# Altium project River Level Sensor Datalogger.PrjPcb
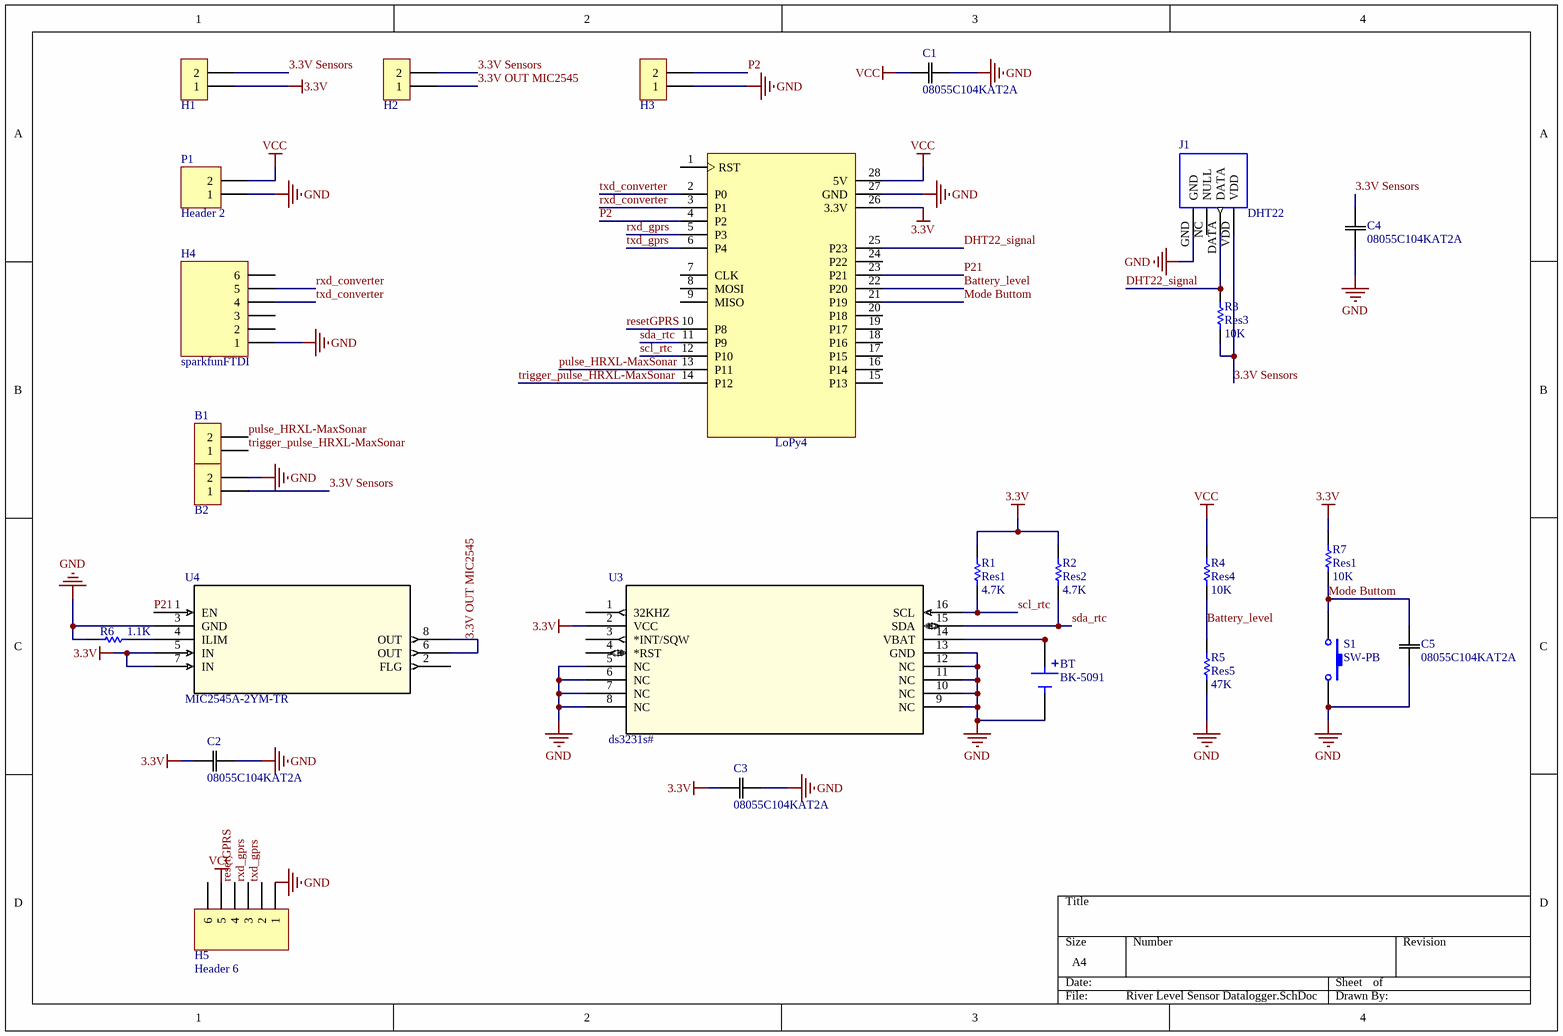
[diagram p0: River Level Sensor Datalogger.SchDoc]
1 sheet, 26 parts. Net scope: global (net labels, ports and power ports of the same name join across sheets).
Board file: River Level Sensor Datalogger.PcbDoc

## Sheet River Level Sensor Datalogger.SchDoc
size A4

### Parts
B1  Borne  [BORNE2]  (value not drawn)
B2  Borne  [BORNE2]  (value not drawn)
BT  BK-5091  [BAT_BK-5091]
C1  08055C104KAT2A  [CAP_X7R_0805_AVX]
C2  08055C104KAT2A  [CAP_X7R_0805_AVX]
C3  08055C104KAT2A  [CAP_X7R_0805_AVX]
C4  08055C104KAT2A  [CAP_X7R_0805_AVX]
C5  08055C104KAT2A  [CAP_X7R_0805_AVX]
H1  Header  [Header 1X2]  (value not drawn)
H2  Header  [Header 1X2]  (value not drawn)
H3  Header  [Header 1X2]  (value not drawn)
H4  sparkfunFTDI  [sparkfunFTDI]
H5  Header 6  [Header 1X6]
J1  DHT22  [DHT22]
P1  Header 2  [BORNERA25-2]
R1  Res1  value 4.7K  [0805]
R2  Res2  value 4.7K  [0805]
R3  Res3  value 10K  [0805]
R4  Res4  value 10K  [0805]
R5  Res5  value 47K  [0805]
R6  value 1.1K  [0805]
R7  Res1  value 10K  [0805]
S1  SW-PB  [BUTTON-1-SMD]
U2  LoPy4  [LoPy]
U3  ds3231s#  [21-0042B_16_MXM]
U4  MIC2545A-2YM-TR  [SOP-8_MCH]

### Nets
3.3V: C2.2 C3.2 H1.1 R1.1 R2.1 R7.1 U2.26(3.3V) U3.2(VCC) U4.5(IN) U4.7(IN)
GND: B2.2 BT.NEG C1.1 C2.1 C3.1 C4.1 C5.1 H3.1 H4.1 H5.1 J1.GND P1.1 R5.2 R6.1 S1.2 U2.27(GND) U3.5(NC) U3.6(NC) U3.7(NC) U3.8(NC) U3.9(NC) U3.10(NC) U3.11(NC) U3.12(NC) U3.13(GND) U4.3(GND)
VCC: C1.2 H5.5 P1.2 R4.1 U2.28(5V)
3.3V OUT MIC2545: H2.1 U4.6(OUT) U4.8(OUT)
3.3V Sensors: B2.1 C4.2 H1.2 H2.2 J1.VDD R3.2
Battery_level: R4.2 R5.1 U2.22(P20)
DHT22_signal: J1.DATA R3.1 U2.25(P23)
Mode Buttom: C5.2 R7.2 S1.1 U2.21(P19)
P2: H3.2 U2.4(P2)
P21: U2.23(P21) U4.1(EN)
pulse_HRXL-MaxSonar: B1.2 U2.13(P11)
resetGPRS: H5.4 U2.10(P8)
rxd_converter: H4.5 U2.3(P1)
rxd_gprs: H5.3 U2.5(P3)
scl_rtc: R1.2 U2.12(P10) U3.16(SCL)
sda_rtc: R2.2 U2.11(P9) U3.15(SDA)
trigger_pulse_HRXL-MaxSonar: B1.1 U2.14(P12)
txd_converter: H4.4 U2.2(P0)
txd_gprs: H5.2 U2.6(P4)
NetBT_1+: BT.1+(POS) BT.2+(POS) U3.14(VBAT)
NetR6_2: R6.2 U4.4(ILIM)

Not connected (* = marked no-connect by the designer): H4 2 3 6; H5 6; J1 NC(NULL); U2 1(RST) 7(CLK) 8(MOSI) 9(MISO) 15(P13) 16(P14) 17(P15) 18(P16) 19(P17) 20(P18) 24(P22); U3 1(32KHZ) 3(*INT/SQW) 4(*RST); U4 2(FLG)

### Library data of the parts
B1 B2 = Borne2: Terminal Atornillable 2 salidas
BT = BK-5091: Battery Retainer Coin, 11.6mm 1 Cell PC Pin; MF: MPD; SnapEDA_Link: https://www.snapeda.com/parts/BK-5091/MPD/view-part/4480565/?ref=snap; Value: *; MP: BK-5091; DigiKey-Purchase-URL: https://snapeda.com/shop?store=DigiKey&id=4480565; Package: None; Digi-Key_Part_Number: BK-5091-ND
C1-C5 = 08055C104KAT2A: No Description Available; Vendor: AVX Corporation; Built_By: EMA_UL_Team; SourceLibrary: AVX_2012-08-08; Type: DEV; Manufacturer_Part_Number: 08055C104KAT2A; Copyright: Copyright (C) 2018 Accelerated Designs. All rights reserved; RefDes: RefDes
H1-H3 = Header 2: Header 2 pin
H4 = sparkfunFTDI: Header, 6-Pin; LatestRevisionDate: 17-Jul-2002; LatestRevisionNote: Re-released for DXP Platform.; Publisher: Altium Limited
H5 = Header 6: Header, 6-Pin; LatestRevisionDate: 17-Jul-2002; LatestRevisionNote: Re-released for DXP Platform.; Publisher: Altium Limited
J1 = DHT22: Capacitive-type humidity and temperature module/sensor; MF: Aosong Electronics; MP: DHT22; Value: *; Check_prices: https://www.snapeda.com/parts/DHT22/Aosong%20Electronics/view-part/5164503/?ref=eda; Package: Package; Availability: Unavailable; Price: None; SnapEDA_Link: https://www.snapeda.com/parts/DHT22/Aosong%20Electronics/view-part/5164503/?ref=snap
P1 = Header 2: Header, 2-Pin; LatestRevisionDate: 17-Jul-2002; LatestRevisionNote: Re-released for DXP Platform.; Publisher: Altium Limited
R1-R7 = Res1: Resistor; Published: 8-Jun-2000; LatestRevisionDate: 17-Jul-2002; LatestRevisionNote: Re-released for DXP Platform.; PackageReference: AXIAL-0.3; Publisher: Altium Limited; PackageDescription: Axial Device, Thru-Hole; 2 Leads; 0.3 in Pin Spacing
S1 = SW-PB: Switch; Published: 24-Mar-1999; LatestRevisionDate: 17-Jul-2002; LatestRevisionNote: Re-released for DXP Platform.; PackageReference: SPST-2; Publisher: Altium Limited; PackageDescription: Switch; 2 Leads
U2 = LoPy: LoPy, Wifi and Bluetooth Microcontroller, 4M RAM, 4 MHz, 28-Pin, 3.0 to 5.5V Supply Range, Commercial Temperature; ComponentAvailability: Unknown. Contact manufacturer to determine status.; Published: 11-Oct-2004; LatestRevisionDate: 29-Jan-2009; LatestRevisionNote: Sch. layout revised. 3D Model Removed.; DatasheetVersion: revD, Mar-2002; PackageVersion: revBB, Aug-2009; PackageReference: PDIP600-P28; Publisher: Altium Limited; PackageDescription: 28-Lead Plastic Dual In-Line (P) - 600 mil Body [PDIP]; Supplier 1: Digi-Key; Supplier Part Number 1: PIC16C55A-04/P-ND; Supplier 2: Farnell; Supplier Part Number 2: 1523784; Supplier 3: Farnell; Supplier Part Number 3: 1084287; Code_JEDEC: MO-011; ComponentLink1Description: Datasheet; ComponentLink1URL: http://ww1.microchip.com/downloads/en/DeviceDoc/30453d.pdf; ComponentLink2Description: Packaging Specification; ComponentLink2URL: http://www.microchip.com/stellent/groups/techpub_sg/documents/packagingspec/en012702.pdf; ComponentLink3Description: Microchip.com Home; ComponentLink3URL: http://www.microchip.com/
U3 = ds3231s#: No Description Available; Vendor: Maxim Integrated Products; Built_By: EMA_UL_Team; SourceLibrary: Maxim_2009-12-17_1; Manufacturer_Part_Number: ds3231s#; Copyright: Copyright (C) 2018 Accelerated Designs. All rights reserved; RefDes: RefDes; Type: DEV
U4 = MIC2545A-2YM-TR: No Description Available; Vendor: Microchip; Built_By: EMA_Molly; SourceLibrary: Microchip_2019-09-03; Manufacturer_Part_Number: MIC2545A-2YM-TR; Copyright: Copyright (C) 2018 Accelerated Designs. All rights reserved; RefDes: RefDes; Type: DEV